# EAGLE design mightywatt (EAGLE 6.4)
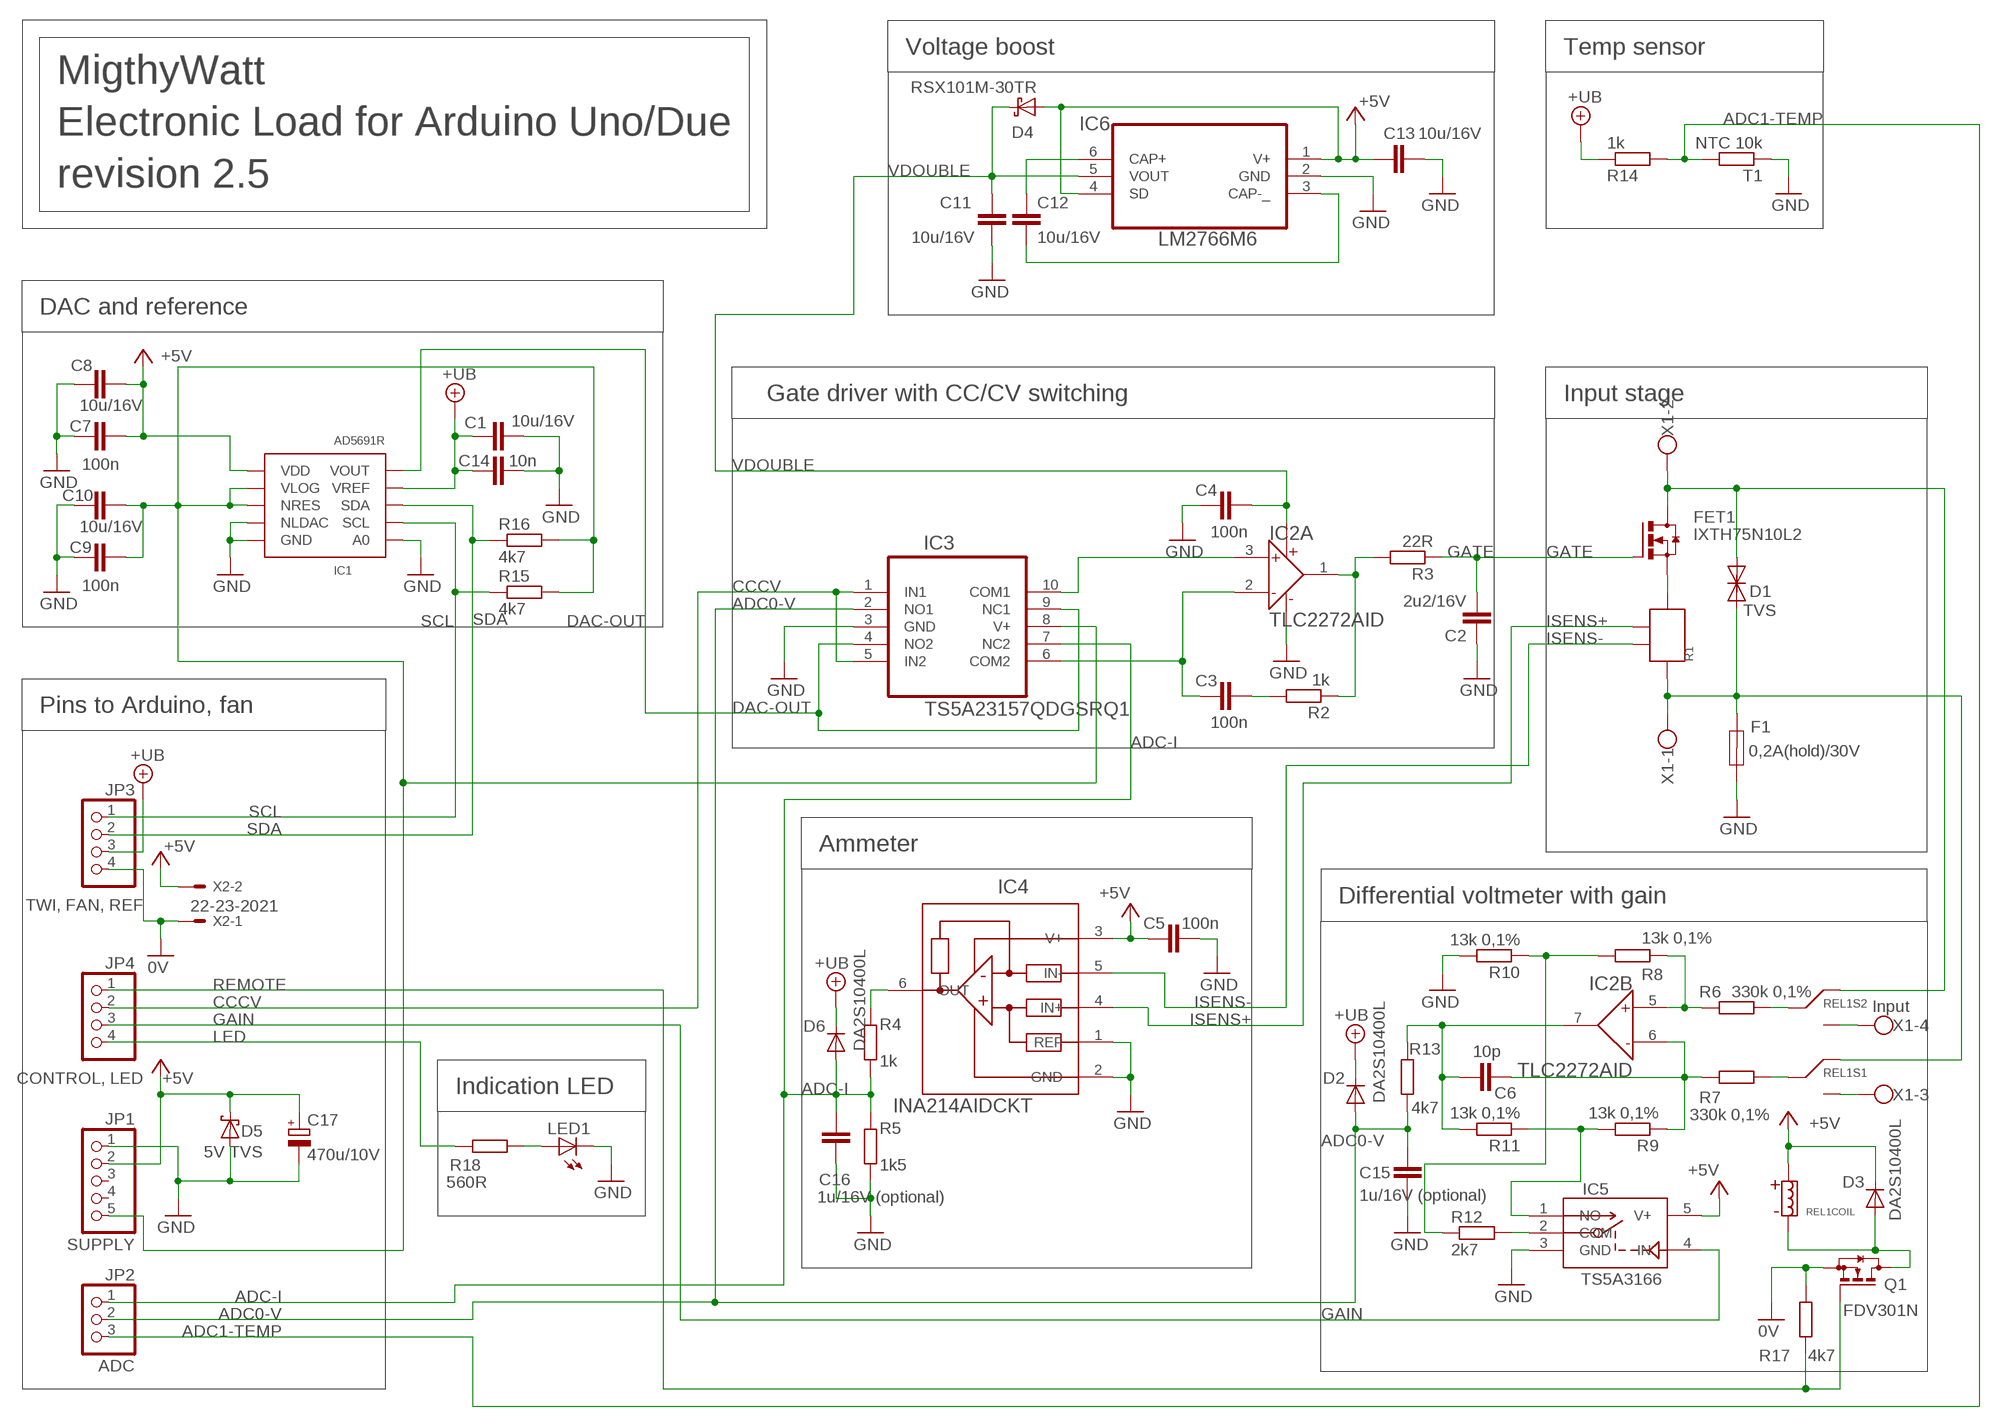
[diagram p0: schematic, sheet 1]

## Parts
C1  10u/16V  C-EUC1206  [C1206]
C2  2u2/16V  C-EUC1206  [C1206]
C3  100n  C-EUC0603  [C0603]
C4  100n  C-EUC0603  [C0603]
C5  100n  C-EUC0603  [C0603]
C6  10p  C-EUC0603  [C0603]
C7  100n  C-EUC0603  [C0603]
C8  10u/16V  C-EUC1206  [C1206]
C9  100n  C-EUC0603  [C0603]
C10  10u/16V  C-EUC1206  [C1206]
C11  10u/16V  C-EUC1206  [C1206]
C12  10u/16V  C-EUC1206  [C1206]
C13  10u/16V  C-EUC1206  [C1206]
C14  10n  C-EUC0805  [C0805]
C15  1u/16V (optional)  C-EUC0603  [C0603]
C16  1u/16V (optional)  C-EUC0603  [C0603]
C17  470u/10V  CPOL-EUSMCE  [SMC_E]
D1  TVS  DIODE-SMC  [SMC]
D2  DA2S10400L  DIODE-SOD523  [SOD523]
D3  DA2S10400L  DIODE-SOD523  [SOD523]
D4  RSX101M-30TR  DIODE-SOD123  [SOD123]
D5  5V TVS  SCHOTTKY-DIODESMD  [SMB]
D6  DA2S10400L  DIODE-SOD523  [SOD523]
F1  0,2A(hold)/30V  LITTELFUSE_1812_500MA  [R1812]
FET1  IXTH75N10L2  [TO-247AD-H]
IC1  AD5691RAD5691R  [SOP50P490X110-10N]
IC2  TLC2272AID  [SOIC127P600X175-8N]
IC3  TS5A23157QDGSRQ1  [SOP50P490X110-10N]
IC4  INA214AIDCKT  [SOT65P210X110-6N]
IC5  TS5A3166  [SC70-5]
IC6  LM2766M6  [SOT95P285X122-6N]
JP1  SUPPLY  PINHD-1X5  [1X05]
JP2  ADC  PINHD-1X3  [1X03]
JP3  TWI, FAN, REF  PINHD-1X4  [1X04]
JP4  CONTROL, LED  PINHD-1X4  [1X04]
LED1  LEDCHIP-LED0805  [CHIP-LED0805]
Q1  BSS123  [SOT23]
R1  WSL3637  [POWER-R-4TERM]
R2  1k  R-EU_R0603  [R0603]
R3  22R  R-EU_R0603  [R0603]
R4  1k  R-EU_R0603  [R0603]
R5  1k5  R-EU_R0603  [R0603]
R6  330k 0,1%  R-EU_R0603  [R0603]
R7  330k 0,1%  R-EU_R0603  [R0603]
R8  13k 0,1%  R-EU_R0603  [R0603]
R9  13k 0,1%  R-EU_R0603  [R0603]
R10  13k 0,1%  R-EU_R0603  [R0603]
R11  13k 0,1%  R-EU_R0603  [R0603]
R12  2k7  R-EU_R0603  [R0603]
R13  4k7  R-EU_R0603  [R0603]
R14  1k  R-EU_R0603  [R0603]
R15  4k7  R-EU_R0603  [R0603]
R16  4k7  R-EU_R0603  [R0603]
R17  4k7  R-EU_R0603  [R0603]
R18  560R  R-EU_R0603  [R0603]
REL1  IM03NS  [IM03NS-NARROW-RELAY]
T1  NTC 10k  R-EU_R0402  [R0402]
X1  Input  W237-4  [W237-4]
X2  22-23-2021  [22-23-2021]

## Nets
0V: JP3.4 Q1.2(S) R17.1 X2.1
+5V: C5.1 C7.2 C8.2 C13.1 C17.+ D3.C D4.A D5.C IC1.1(VDD) IC4.3(V+) IC5.5(V+) IC6.1(V+) IC6.4(SD) JP1.2 REL1.P$1(COIL:C+) X2.2
+UB: C1.1 C14.1 D2.C D6.C IC1.9(VREF) JP3.3 R14.1
ADC0-V: C15.2 D2.A IC3.2(NO1) JP2.2 R13.1
ADC1-TEMP: JP2.3 R14.2 T1.2
ADC-I: C16.2 D6.A IC3.7(NC2) JP2.1 R4.2 R5.1
CCCV: IC3.1(IN1) IC3.5(IN2) JP4.2
DAC-OUT: IC1.10(VOUT) IC3.4(NO2) IC3.9(NC1)
GAIN: IC5.4(IN) JP4.3
GATE: C2.2 FET1.G R3.1
GND: C1.2 C2.1 C4.1 C5.2 C7.1 C8.1 C9.1 C10.1 C11.2 C13.2 C14.2 C15.1 C16.1 C17.- D5.A F1.2 IC1.4(NLDAC) IC1.5(GND) IC1.6(A0) IC2.4(C:V-/GND) IC3.3(GND) IC4.1(REF) IC4.2(GND) IC5.3(GND) IC6.2(GND) JP1.1 LED1.C R5.2 R10.2 T1.1
IOREF: C9.2 C10.2 IC1.2(VLOG) IC1.3(NRES) IC3.8(V+) JP1.5 R15.2 R16.2
ISENS+: IC4.4(IN+) R1.SENSE2
ISENS-: IC4.5(IN-) R1.SENSE1
LED: JP4.4 R18.1
N$1: IC2.5(B:IN+) R6.2 R8.1
N$2: D1.A F1.1 R1.POWER1 REL1.P$2(S1:NC) X1.1
N$3: C6.1 IC2.6(B:IN-) R7.2 R9.1
N$4: D1.C FET1.D REL1.P$7(S2:NC) X1.2
N$5: C12.1 IC6.6(CAP+)
N$6: C12.2 IC6.3(CAP-_)
N$8: R8.2 R10.1 R12.1
N$9: REL1.P$4(S1:NO) X1.3
N$10: REL1.P$5(S2:NO) X1.4
N$11: FET1.S R1.POWER2
N$12: IC2.1(A:OUT) R2.1 R3.2
N$13: R6.1 REL1.P$6(S2:COM)
N$14: IC5.2(COM) R12.2
N$15: IC5.1(NO) R9.2 R11.1
N$16: LED1.A R18.2
N$17: R7.1 REL1.P$3(S1:COM)
N$18: C3.2 R2.2
N$19: C3.1 IC2.2(A:IN-) IC3.6(COM2)
N$20: C6.2 IC2.7(B:OUT) R11.2 R13.2
N$23: IC2.3(A:IN+) IC3.10(COM1)
N$24: D3.A Q1.3(D) REL1.P$8(COIL:C-)
R3: IC4.6(OUT) R4.1
REMOTE: JP4.1 Q1.1(G) R17.2
SCL: IC1.7(SCL) JP3.1 R15.1
SDA: IC1.8(SDA) JP3.2 R16.1
VDOUBLE: C4.2 C11.1 D4.C IC2.8(C:V+) IC6.5(VOUT)
Unconnected: JP1.3 JP1.4

## Notes on the sheet
- MigthyWatt
  Electronic Load for Arduino Uno/Due
  revision 2.5
- Voltage boost | Temp sensor
- DAC and reference
- Gate driver with CC/CV switching | Input stage
- Pins to Arduino, fan
- Ammeter
- Differential voltmeter with gain
- Indication LED

## Library data of the parts
C1-C16 = rcl:C-EU: CAPACITOR, European symbol
C17 = rcl:CPOL-EU: POLARIZED CAPACITOR, European symbol
D1 = diode-tvs:DIODE-: DIODE
D2 D3 D6 = diode:DIODE-: DIODE
D4 = diode-schottky:DIODE-: DIODE
D5 = diode:SCHOTTKY-DIODE: Schottky Diode
F1 = fuses_polyswitch:LITTELFUSE_1812; MPN: 1812L050PR; OC_FARNELL: 1597001; PACKAGE: 1812; SUPPLIER: LITTELFUSE
FET1 = fet:IXTH75N10L2: IXYS L2 POWER MOSFET
IC1 = load:AD5691R: Analog Devices AD5691R 12-bit DAC I2C, REF out; MODEL: AD5691R
IC2 = load:TLC2272AID: OPERATIONAL AMPLIFIERS; MPN: TLC2272AID; OC_FARNELL: 1470357; OC_NEWARK: 08F9015; PACKAGE: SOIC-8; SUPPLIER: Texas Instruments
IC3 = load:TS5A23157QDGSRQ1: 5-V/3.3-V 2-CHANNEL 2:1 MULTIPLEXER/DEMULTIPLEXER; MPN: TS5A23157QDGSRQ1; OC_FARNELL: 2322041; PACKAGE: MSOP-10; SUPPLIER: Texas Instruments
IC4 = load:INA214AIDCKT: CURRENT SHUNT MONITOR; MPN: INA214BIDCKT; OC_FARNELL: 1754262; OC_NEWARK: 05N1041; PACKAGE: SC-70-6; SUPPLIER: Texas Instruments
IC5 = load:TS5A3166: 0.9-Ohm SPST analog switch
IC6 = texas:LM2766M6: IC SW CAP/DBLR ADJ 20MA; MPN: LM2766M6; OC_FARNELL: 1685633; OC_NEWARK: 41K4345; PACKAGE: SOT-23-6; SUPPLIER: National Semiconductor
JP1 = pinhead (actionpin-3,4,5,6):PINHD-1X5: PIN HEADER
JP2 = pinhead (actionpin-3,4,5,6):PINHD-1X3: PIN HEADER
JP3 JP4 = pinhead (actionpin-3,4,5,6):PINHD-1X4: PIN HEADER
LED1 = led:LED: LED OSRAM: - CHIPLED LG R971, LG N971, LY N971, LG Q971, LY Q971, LO R971, LY R971 LH N974, LH R974 LS Q976, LO Q976, LY Q976 LO Q996 - Hyper CHIPLED LW Q18S LB Q993, LB Q99A, LB R99A - SideLED LS A670, LO A670, LY A670, LG A670, LP A670 LB A673, LV A673, LT A673, LW A673 LH A674 LY A675 LS A676, LA A676, LO A676, LY A676, LW A676 LS A679, LY A679, LG A679 - Hyper Micro SIDELED® LS Y876, LA Y876, LO Y876, LY Y876 LT Y87S - SmartLED LW L88C, LW L88S LB L89C, LB L89S, LG L890 LS L89K, LO L89K, LY L89K LS L896, LA L896, LO L896, LY L896 - TOPLED LS T670, LO T670, LY T670, LG T670, LP T670 LSG T670, LSP T670, LSY T670, LOP T670, LYG T670 LG T671, LOG T671, LSG T671 LB T673, LV T673, LT T673, LW T673 LH T674 LS T676, LA T676, LO T676, LY T676, LB T676, LH T676, LSB T676, LW T676 LB T67C, LV T67C, LT T67C, LS T67K, LO T67K, LY T67K, LW E67C LS E67B, LA E67B, LO E67B, LY E67B, LB E67C, LV E67C, LT E67C LW T67C LS T679, LY T679, LG T679 LS T770, LO T770, LY T770, LG T770, LP T770 LB T773, LV T773, LT T773, LW T773 LH T774 LS E675, LA E675, LY E675, LS T675 LS T776, LA T776, LO T776, LY T776, LB T776 LHGB T686 LT T68C, LB T68C - Hyper Mini TOPLED® LB M676 - Mini TOPLED Santana® LG M470 LS M47K, LO M47K, LY M47K Source: http://www.osram.convergy.de LUXEON: - LUMILED® LXK2-PW12-R00, LXK2-PW12-S00, LXK2-PW14-U00, LXK2-PW14-V00 LXK2-PM12-R00, LXK2-PM12-S00, LXK2-PM14-U00 LXK2-PE12-Q00, LXK2-PE12-R00, LXK2-PE12-S00, LXK2-PE14-T00, LXK2-PE14-U00 LXK2-PB12-K00, LXK2-PB12-L00, LXK2-PB12-M00, LXK2-PB14-N00, LXK2-PB14-P00, LXK2-PB14-Q00 LXK2-PR12-L00, LXK2-PR12-M00, LXK2-PR14-Q00, LXK2-PR14-R00 LXK2-PD12-Q00, LXK2-PD12-R00, LXK2-PD12-S00 LXK2-PH12-R00, LXK2-PH12-S00 LXK2-PL12-P00, LXK2-PL12-Q00, LXK2-PL12-R00 Source: www.luxeon.com KINGBRIGHT: KA-3528ASYC Source: www.kingbright.com
Q1 = transistor-small-signal:BSS123: N-CHANNEL MOS FET; PARTNAME: FDV301N
R1 = moje:WSL3637
R2-R18 T1 = rcl:R-EU_: RESISTOR, European symbol
REL1 = relays:IM03NS: Relay DPDT THT narrow 5V: IM03NS, UA2-5NU
X1 = con-wago-500-modified:W237-4: WAGO SCREW CLAMP; OC_FARNELL: unknown; OC_NEWARK: unknown
X2 = con-molex:22-23-2021: .100" (2.54mm) Center Header - 2 Pin; MF: MOLEX; MPN: 22-23-2021; OC_FARNELL: 1462926; OC_NEWARK: 25C3832

## Board
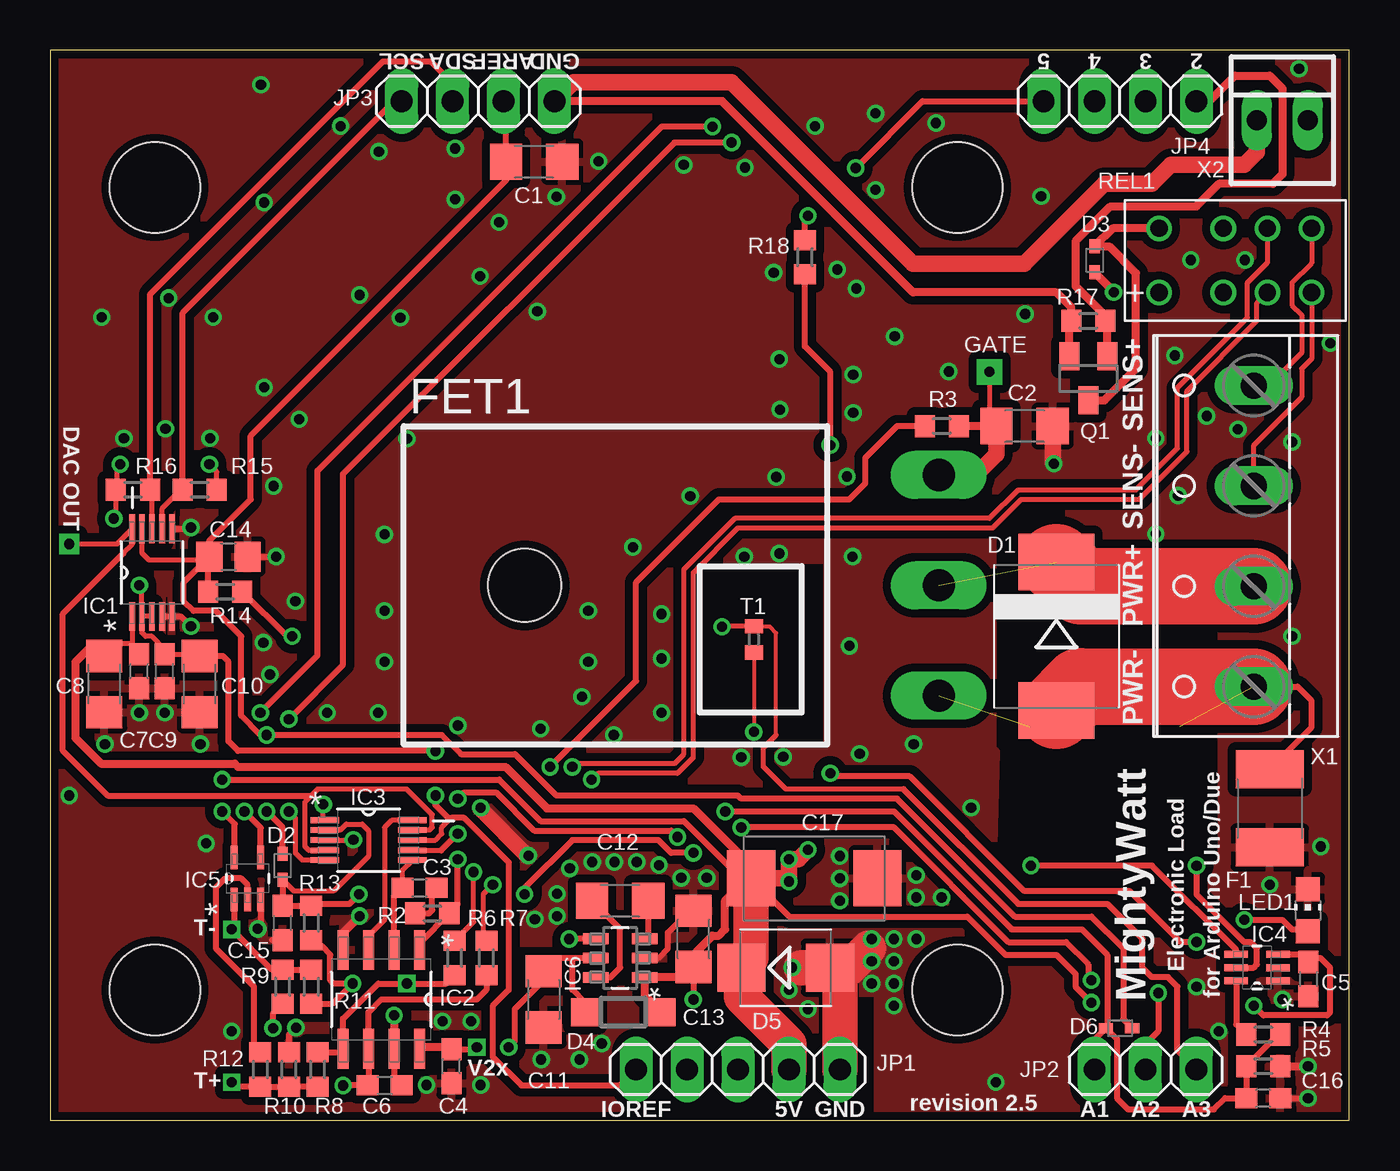
[diagram p1: board, top side]
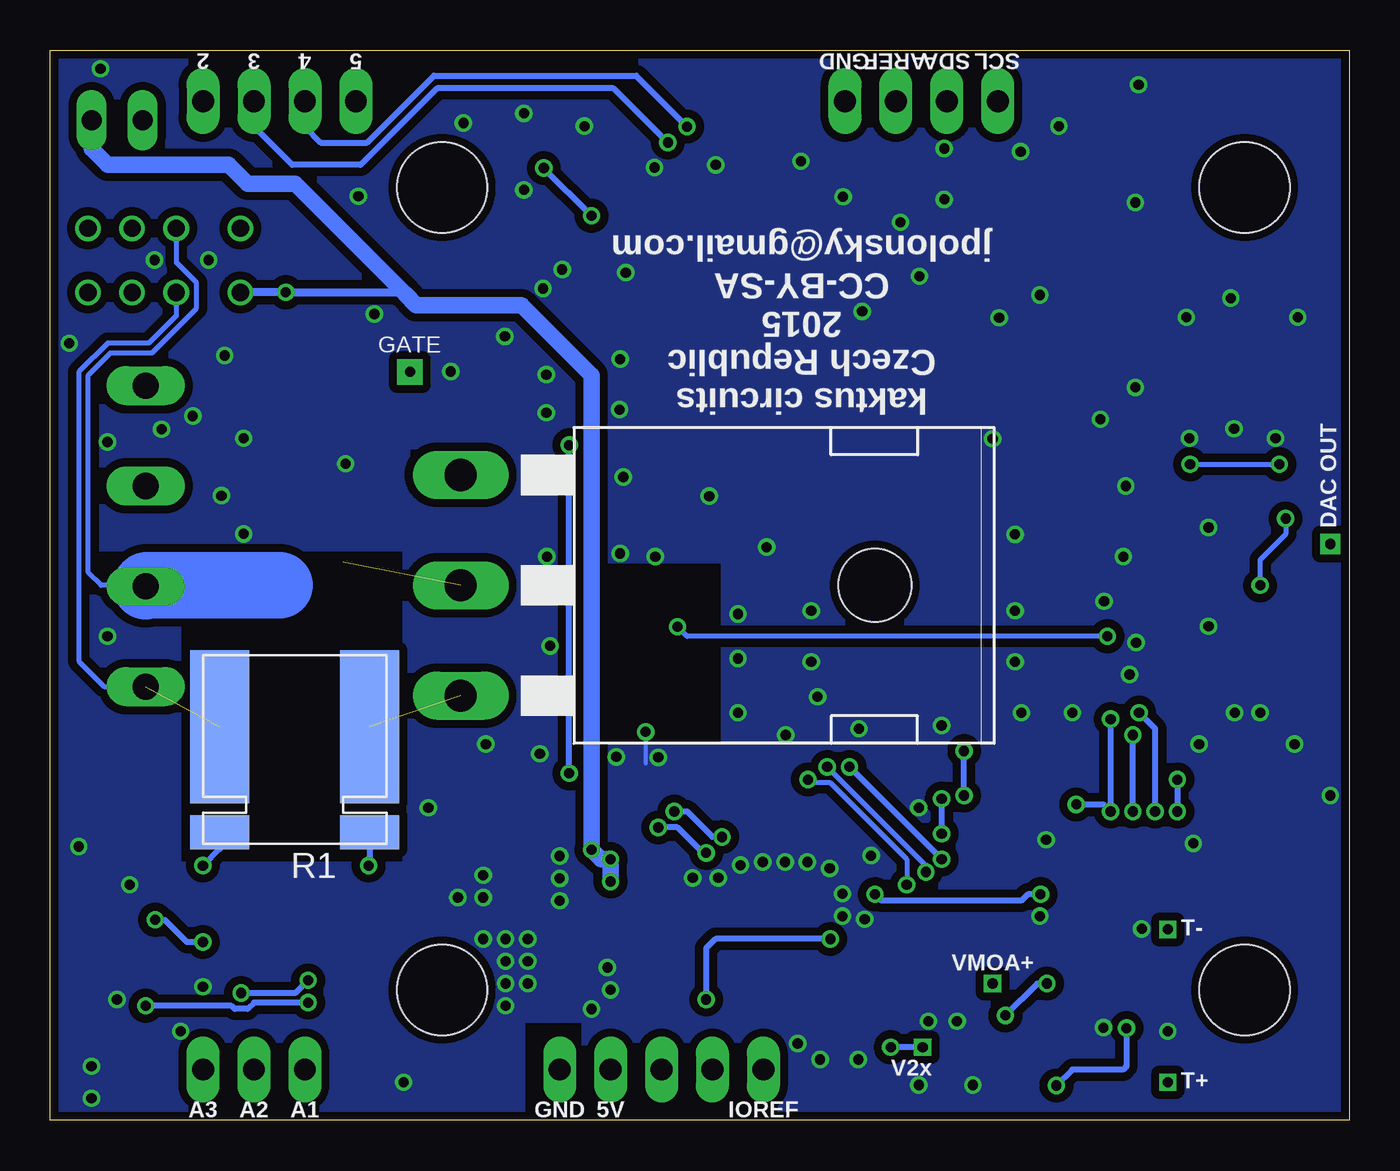
[diagram p2: board, bottom side, seen from below]

Size 64.77 x 53.34 mm. Coordinates in mm from the lower left corner, seen from the top.
Outline: 0,0 64.77,0 64.77,53.34 0,53.34 0,0
Copper layers (1*16): Top 0.0356mm / dielectric 1.5011mm / Bottom 0.0356mm
Design rules "OSHPark - LaenPCBOrder *": minimum track width 6mil, minimum drill 13mil, track to track 6mil, track to pad 6mil, pad to pad 6mil, via to via 6mil, smd to smd 6mil, copper to edge 15mil, drill to drill 6mil, minimum pad ring 7mil, minimum via ring 7mil, stop-mask expansion 3mil, vias tented up to drill 0mil, thermal gap 10mil
Holes 4.5 mm at 5.23,6.5 5.23,46.5 45.23,46.5 45.23,6.5

### Footprints (pad centres in the part's own frame; a part is rotated, then mirrored left to right if it is on the bottom)
C1206 = smd 1.6 x 1.8: 1 -1.4,0; 2 1.4,0
C0603 = smd 1.1 x 1: 1 -0.85,0; 2 0.85,0
C0805 = smd 1.3 x 1.5: 1 -0.95,0; 2 0.95,0
SMC_E = smd 2.4 x 2.8: + -3.15,0; - 3.15,0
SMC = smd 2.8 x 3.8: A 3.7,0; C -3.7,0
SOD523 = smd 0.7 x 0.5: A 0.7,0; C -0.6,0
SOD123 = smd 1.4 x 1.4: A 1.9,0; C -1.9,0
SMB = smd 2.4 x 2.4: A 2.2,0; C -2.2,0
R1812 = smd 1.9 x 3.4: 1 -1.95,0; 2 1.95,0
TO-247AD-H = drill 1.6 long: D 0,-20.65; G -5.5,-20.65; S 5.5,-20.65 | hole 3.65: 0,0
SOP50P490X110-10N = smd 1.422 x 0.279: 1 -2.184,0.991; 2 -2.184,0.508; 3 -2.184,0; 4 -2.184,-0.508; 5 -2.184,-0.991; 6 2.184,-0.991; 7 2.184,-0.508; 8 2.184,0; 9 2.184,0.508; 10 2.184,0.991
SOIC127P600X175-8N = smd 1.981 x 0.559: 1 -2.464,1.905; 2 -2.464,0.635; 3 -2.464,-0.635; 4 -2.464,-1.905; 5 2.464,-1.905; 6 2.464,-0.635; 7 2.464,0.635; 8 2.464,1.905
SOT65P210X110-6N = smd 1.168 x 0.356: 1 -1.041,0.66; 2 -1.041,0; 3 -1.041,-0.66; 4 1.041,-0.66; 5 1.041,0; 6 1.041,0.66
SC70-5 = smd 1.168 x 0.356: 1 -1.041,0.66; 2 -1.041,0; 3 -1.041,-0.66; 4 1.041,-0.66; 5 1.041,0.66
SOT95P285X122-6N = smd 1.27 x 0.533: 1 -1.219,0.965; 2 -1.219,0; 3 -1.219,-0.965; 4 1.219,-0.965; 5 1.219,0; 6 1.219,0.965
1X05 = drill 1.092 long: 1 -5.08,0; 2 -2.54,0; 3 0,0; 4 2.54,0; 5 5.08,0
1X03 = drill 1.092 long: 1 -2.54,0; 2 0,0; 3 2.54,0
1X04 = drill 1.092 long: 1 -3.81,0; 2 -1.27,0; 3 1.27,0; 4 3.81,0
CHIP-LED0805 = smd 1.2 x 1.2: A 0,-1.05; C 0,1.05
SOT23 = smd 1 x 1.4: 1 -0.95,-1.1; 2 0.95,-1.1; 3 0,1.1
POWER-R-4TERM = smd 7.62 x 2.946: POWER1 1.016,-2.972; POWER2 1.016,4.496 | smd 1.676 x 2.946: SENSE1 6.274,-2.972; SENSE2 6.274,4.496
R0603 = smd 1 x 1.1: 1 -0.85,0; 2 0.85,0
IM03NS-NARROW-RELAY = drill 0.85: P$1 -2.5,-1.6; P$2 0.7,-1.6; P$3 2.9,-1.6; P$4 5.1,-1.6; P$5 5.1,1.6; P$6 2.9,1.6; P$7 0.7,1.6; P$8 -2.5,1.6
R0402 = smd 0.7 x 0.9: 1 -0.65,0; 2 0.65,0
W237-4 = drill 1.3 long: 1 -7.5,-1.27; 2 -2.5,-1.27; 3 2.5,-1.27; 4 7.5,-1.27
22-23-2021 = drill 1 long: 1 -1.27,0; 2 1.27,0

### Placement (x,y rotation side)
C1  24.13,47.78 0 top
C2  48.58,34.61 180 top
C3  18.41,11.59 0 top
C4  20,2.7 90 top
C5  62.72,7.05 270 top
C6  16.67,1.75 0 top
C7  4.45,22.38 90 top
C8  2.7,21.75 90 top
C9  5.71,22.38 90 top
C10  7.46,21.75 90 top
C11  24.61,6.03 270 top
C12  28.42,10.95 0 top
C13  32.07,9.05 90 top
C14  8.89,28.1 0 top
C15  11.59,9.84 90 top
C16  60.48,1.11 180 top
C17  38.1,12.06 0 top
D1  50.16,24.13 270 top
D2  11.59,12.7 270 top
D3  52.07,42.86 90 top
D4  28.57,5.4 0 top
D5  36.67,7.62 0 top
D6  53.34,4.6 180 top
F1  60.8,15.56 270 top
FET1  23.65,26.67 270 bottom
IC1  5.08,27.3 90 top
IC2  16.51,6.03 270 top
IC3  15.88,13.97 0 top
IC4  60.17,7.62 180 top
IC5  9.84,12.06 90 top
IC6  28.42,8.1 180 top
JP1  34.29,2.54 180 top
JP2  54.61,2.54 0 top
JP3  21.34,50.8 0 top
JP4  53.34,50.8 180 top
LED1  62.71,10.48 0 top
Q1  51.75,36.99 180 top
R1  53.34,20.64 270 bottom
R2  19.05,10.32 180 top
R3  44.45,34.61 180 top
R4  60.48,4.29 0 top
R5  60.48,2.7 0 top
R6  20.16,8.1 270 top
R7  21.75,8.1 270 top
R8  13.34,2.54 270 top
R9  11.59,6.67 90 top
R10  11.91,2.54 90 top
R11  13.02,6.67 270 top
R12  10.48,2.54 90 top
R13  13.02,9.84 270 top
R14  8.73,26.35 0 top
R15  7.46,31.43 0 top
R16  4.13,31.43 180 top
R17  51.75,39.85 0 top
R18  37.62,43.02 270 top
REL1  57.78,42.86 0 top
T1  35.08,23.97 90 top
X1  58.74,29.12 90 top
X2  61.44,49.85 0 top

### Tracks (layer width: path | path; a pad name or v marks a point on that pad's centre or on a via)
0V
  Top 0.406: JP3.4 33.5,50.8 43.02,41.27 50.16,41.27 50.9,40.54 R17.1 50.8,39.75 Q1.2
  Top 0.813: JP3.4 26.1,51.75 33.97,51.75 43.02,42.7 48.58,42.7 52.55,46.67 54.93,46.67 55.88,47.62 59.53,47.62 60.17,48.26 X2.1
+5V  (via drill 0.51)
  Top 0.254: IC1.1 4.09,23.75 | 4.09,23.75 3.3,23.75 C8.2 | C7.2 4.45,23.39 4.09,23.75
  Top 0.305: 31.55,7.13 C13.1 | IC6.4 v25.89,9.06 v25.88,9.05 | C13.1 32.07,7.94 | C13.1 v32.07,6.03 | v8.57,16.99 22.38,16.99 24.45,14.92 31.59,14.92 34.45,12.06 | IC4.3 62.34,8.28 C5.1 62.92,8.1 63.34,8.1 63.82,7.62 63.82,5.4 63.66,5.24 60.48,5.24 v60.01,5.71 | 34.45,12.06 C17.+ 36.85,10.16 45.72,10.16 47.62,8.26 50.16,8.26 51.12,7.3 51.12,6.67 v51.91,5.87 | 34.45,12.06 34.45,12.57 34.29,12.72 | IC5.5 9.21,13.13 9.21,14.76 v8.57,15.4
  Top 0.406: C8.2 2.35,23.5 1.91,23.5 1.27,22.86 1.27,19.05 2.54,17.78 9.21,17.78 9.37,17.62 22.7,17.62 24.77,15.56 32.07,15.56 34.29,13.34 34.29,12.72 | C13.1 32.22,7.8 32.22,8.41 33.02,9.21 33.34,9.21 33.66,9.53 33.66,10.95 34.29,11.59 34.47,11.59 C17.+ 34.92,12.09 34.9,12.09 | 31.55,7.13 IC6.1 29.64,6.24 D4.A | 34.45,7.64 D5.C | v53.02,41.27 53.02,41.31 D3.C
  Top 0.813: C17.+ 36.67,12.06 v36.83,11.91 v36.83,13.02 37.31,13.02 v37.78,13.49
  Top 1.778: JP1.2 36.83,3.81 34.47,6.17 D5.C 34.95,8.1 C17.+
  Bottom 0.305: v25.88,9.05 31.59,9.05 32.07,8.57 v32.07,6.03 | v8.57,16.99 v8.57,15.4 | v51.91,5.87 54.61,5.87 54.93,5.56 55.56,5.56 55.72,5.71 v60.01,5.71
  Bottom 0.406: REL1.P$1 55.27,41.27 v53.02,41.27 47.15,41.27 47.07,41.2
  Bottom 0.813: X2.2 62.71,48.42 61.91,47.62 55.88,47.62 54.93,46.67 52.55,46.67 47.07,41.2 46.51,40.64 41.27,40.64 37.78,37.15 v37.78,13.49 37.31,13.02 v36.83,13.02 v36.83,11.91
+UB  (via drill 0.51)
  Top 0.254: IC1.9 4.57,28.29 4.92,27.94 7.78,27.94 C14.1
  Top 0.305: JP3.3 22.73,50.68 C1.1 22.73,46.86 10,34.13 10,30.96 7.94,28.89 C14.1 | C14.1 6.67,26.83 6.67,25.88 7.14,25.4 8.26,25.4 9.53,24.13 9.53,20.16 10.48,19.21 v10.79,19.21 19.53,19.21 20.48,18.26 23.18,18.26 25.24,16.19 34.29,16.19 34.45,16.03 42.23,16.03 48.1,10.16 51.91,10.16 53.5,8.57 53.5,5.04 D6.C | R14.1 7.88,28.04 C14.1 | D2.C 11.59,14.61 v10.79,15.4
  Bottom 0.305: v10.79,15.4 v10.79,19.21
ADC0-V  (via drill 0.51)
  Top 0.254: 11.84,11.75 D2.A 12.16,11.43 14.13,11.43 15.88,13.18 15.88,14.45 15.56,14.76 14.76,14.76 14.48,14.48 IC3.2
  Top 0.305: v51.91,6.99 51.75,7.14 51.75,7.78 50.64,8.89 47.78,8.89 42.07,14.61 v34.45,14.61 | v32.07,13.34 30.96,13.34 30.32,13.97 26.04,13.97 23.65,11.59 v23.65,11.27 | D2.A C15.2 R13.1 13.12,10.79 14.92,10.79 v15.4,11.27 | v55.24,6.35 55.24,4.45 54.61,3.81 JP2.2
  Bottom 0.305: v23.65,11.27 23.34,10.95 16.35,10.95 16.03,11.27 v15.4,11.27 | v51.91,6.99 52.55,6.35 v55.24,6.35 | v32.07,13.34 32.23,13.34 33.5,14.61 v34.45,14.61
ADC1-TEMP  (via drill 0.51)
  Top 0.203: T1.2 35.86,24.62 36.2,24.29 36.2,19.21
  Top 0.254: 42.55,16.51 36.67,16.51 35.56,17.62 35.56,18.57 36.2,19.21 | T1.2 33.51,24.62 v33.5,24.61
  Top 0.305: JP2.3 56.2,3.49 56.2,6.67 55.72,7.14 54.93,7.14 54.45,7.62 54.45,9.05 52.7,10.79 48.26,10.79 42.55,16.51 | v12.06,24.13 11.8,24.13 R14.2
  Bottom 0.254: v12.06,24.13 33.02,24.13 v33.5,24.61
ADC-I  (via drill 0.51)
  Top 0.254: IC3.7 19.49,13.46
  Top 0.305: 19.49,13.46 v20.32,14.29 | v20.32,16.03 20.64,16.35 22.23,16.35 24.13,14.45 30.96,14.45 v31.27,14.13 | v33.66,15.4 42.07,15.4 47.94,9.53 51.44,9.53 52.7,8.26 52.7,4.67 D6.A | R4.2 61.33,4.4 R5.1 C16.2 58.58,1.11 58.02,0.56 53.74,0.56 53.18,1.11 53.18,4.06 D6.A | JP2.1 52.07,4.03 D6.A
  Bottom 0.305: v20.32,14.29 v20.32,16.03 | v33.66,15.4 33.02,15.4 31.75,14.13 v31.27,14.13
CCCV  (via drill 0.51)
  Top 0.254: IC3.1 13.61,15.04 v13.61,15.75 | IC3.5 12.58,12.98 12.22,13.34 12.22,15.08 v11.91,15.4
  Top 0.305: v33.97,48.74 31.11,48.74 14.61,32.23 14.61,22.7 v11.91,20
  Bottom 0.305: v33.97,48.74 36.67,51.44 45.48,51.44 49.29,47.62 52.7,47.62 54.61,49.53 JP4.2 | v13.61,15.75 12.26,15.75 v11.91,15.4 v11.91,20
DAC-OUT  (via drill 0.51 pad 1.02)
  Top 0.254: v0.95,28.73 3.33,28.73 IC1.10 4.09,28.7 3.65,28.26 | IC3.9 18.92,14.48 19.05,14.61 19.05,15.24 17.78,16.51 13.34,16.51 13.02,16.19 12.7,15.88 12.7,13.65 12.89,13.46 IC3.4
  Top 0.305: 3.65,28.26 0.64,25.24 0.64,18.41 2.86,16.19 13.02,16.19
GAIN  (via drill 0.51)
  Top 0.305: v33.02,49.53 30.48,49.53 13.34,32.38 13.34,23.18 v10.48,20.32 | IC5.4 10.5,14.58 v9.68,15.4
  Bottom 0.305: v33.02,49.53 35.56,52.07 45.64,52.07 48.97,48.74 51.28,48.74 52.07,49.53 JP4.3 | v9.68,15.4 9.68,19.53 v10.48,20.32
GATE  (via drill 0.51 pad 1.27)
  Top 0.254: v46.83,37.31 46.83,34.95 C2.2
  Top 0.406: C2.2 R3.1
  Top 0.813: FET1.G 46.14,32.17 47.18,33.21 C2.2
GND  (via drill 0.51)
  Top 0.203: T1.1 v35.08,19.37
  Top 0.254: IC3.3 15.09,13.97 v15.11,13.99
  Top 0.305: R10.2 11.91,4.28 v12.26,4.63 | IC1.6 6.96,29.49 v7.02,29.55 | IC1.4 IC1.5 6.53,25.12 v7.02,24.63 | IC6.2 30.32,8.1 30.8,8.57 30.8,9.37 31.59,10.16 31.78,10.16 C13.2 | C14.2 v11.27,28.1 | C16.1 v62.71,1.11 | IC5.3 10.5,9.86 | C15.1 11.07,8.99
  Top 0.406: R5.2 v62.71,2.7 | IC2.4 14.61,9.36 v15.43,10.18
  Top 0.813: C2.1 49.98,32.79 v50.04,32.73 | 21.43,15.56 23.81,13.18
  Top 1.778: 39.37,7.12 D5.A | 37.47,7.62 39.37,7.62 | 39.37,7.62 39.85,7.62 40.8,8.57 | JP1.1 39.37,7.62
  Bottom 0.203: v35.08,19.37 35.08,17.78
  other vias: 60.8,11.75 0.95,16.19 2.57,40.03 27.34,47.81 63.34,13.65 61.44,6.03 4.45,20.32 5.71,20.32 2.73,18.76 7.49,18.76 47.15,1.91 16.38,48.28 20.19,48.44 10.51,51.62 7.97,34 39.72,32.09 40.2,41.46 43.05,18.76 25.24,46.04 19.56,4.95 40.01,28.1 39.85,23.65 24.45,19.53 8.13,40.03 29.05,28.57 30.48,25.24 30.48,20.32 30.48,23.02 28.1,19.21 34.45,18.1 10.35,9.55 18.77,1.77 40.04,37.17 42.1,39.08 48.61,40.19 55.12,34 56.07,38.12 56.87,42.89 59.56,42.89 57.66,35.11 56.23,31.14 55.12,29.23 38.13,49.55 41.15,46.38 34.64,47.49 36.07,42.25 61.91,24.13 61.91,33.81 59.21,34.45 63.82,38.73 36.99,7.62 40.96,6.83 40.96,7.94 40.96,9.05 42.07,9.05 42.07,7.94 36.83,6.51 62.26,52.41 42.07,6.83 43.18,9.05 42.07,5.71 37.78,5.56 44.8,37.33 7.78,13.81 3.68,34 20.19,45.9 15.43,41.14 10.67,36.54 12.42,34.95 11.15,31.62 22.38,44.77 17.46,40.01 31.59,47.62 21.43,42.07 24.29,40.32 17.78,33.97 16.67,29.21 31.91,31.11 20.32,19.68 26.51,21.11 36.2,32.07 36.35,37.94 34.61,28.1 45.91,15.58 16.35,20.32 13.81,20.32 10.95,22.23 12.22,25.88 40.36,18.28 36.55,18.12 21.46,15.58 16.67,25.4 16.67,22.86 26.83,25.4 26.83,22.86 25.27,11.3 24.48,3.04 32.74,12.09 23.85,13.2 10.64,23.81 5.91,40.98 10.67,45.74 14.48,49.55 5.75,34.47 39.24,42.41 36.39,35.43 49.4,46.06 44.17,49.71 41.15,50.19 9.05,4.45 39.37,13.18 39.37,10.95 39.37,12.06 43.18,12.22 43.18,11.11 44.45,11.11 25.91,12.57 27.02,12.88 28.13,12.88 29.24,12.88 30.35,12.72 31.47,12.09 25.27,10.18 24.16,10.03 27.5,3.83 26.39,3.04 21.46,1.77 20.99,4.95 40.04,35.27 36.35,28.26 57.15,6.67 58.26,4.45
  pour Bottom (isolate 0.406): 0,19.05 47.62,18.41 46.99,12.7 58.42,12.7 58.42,33.66 64.77,33.66 64.77,0 41.27,0 41.27,5.08 38.1,5.08 38.1,0 0,0
  pour Bottom (isolate 0.406): 46.99,33.66 0,33.66 0,53.34 64.77,53.34 64.77,28.57 46.99,28.57
  pour Top (isolate 0.406): 46.99,33.66 24.61,33.66 24.61,53.34 64.77,53.34 64.77,33.66 58.42,33.66 58.42,24.77 46.99,24.77
  pour Top (isolate 0.406): 37.94,44.45 37.47,44.45 37.47,53.34 0,53.34 0,32.86 37.94,32.86
  pour Bottom (isolate 0.406): 31.11,18.73 31.11,27.94 38.73,27.94 38.73,18.41 46.99,18.41 46.99,33.66 0,33.66 0,19.05
  pour Top (isolate 0.406): 31.11,18.73 31.11,27.94 38.73,27.94 38.73,18.41 46.99,18.41 46.99,34.29 0,34.29 0,19.05
  pour Top (isolate 0.406): 0,19.05 47.15,18.41 46.99,12.7 58.42,12.7 58.42,47.62 64.77,47.62 64.77,0 41.27,0 41.27,6.35 38.1,6.35 38.1,0 0,0
IOREF  (via drill 0.51)
  Top 0.254: IC1.3 IC1.2 | IC1.2 4.57,24.32 4.76,24.13 5.08,24.13 5.71,23.5 C9.2 7.38,23.23 C10.2 | IC3.8 19.21,13.97 19.53,14.29 19.53,14.61 19.92,15 | R15.2 8.31,32.33 v7.94,32.7 | IC1.2 4.57,26.54 v4.45,26.67 | v3.17,30 3.28,30.11 R16.2 3.33,31.49 3.33,32.54 v3.49,32.7
  Top 0.305: JP1.5 28.42,1.75 23.5,1.75 22.07,3.17 22.07,5.71 22.86,6.51 22.86,12.86 20.64,15.08 20,15.08 19.92,15 19.21,15.72 v19.21,16.19 | C10.2 8.6,23.15 8.89,22.86 8.89,18.89 9.37,18.41 v19.21,18.41
  Bottom 0.254: v7.94,32.7 v3.49,32.7 | v4.45,26.67 4.45,27.94 3.17,29.21 v3.17,30
  Bottom 0.305: v19.21,16.19 v19.21,18.41
ISENS+  (via drill 0.51)
  Top 0.305: v48.9,12.7 54.93,12.7 59.12,8.5 IC4.4
  Bottom 0.305: R1.SENSE2 48.84,12.75 v48.9,12.7
ISENS-  (via drill 0.51)
  Top 0.305: v57.15,12.7 57.15,11.27 59.53,8.89 59.85,8.89 60.17,8.57 60.17,7.78 60.01,7.62 IC4.5
  Bottom 0.305: v57.15,12.7 56.31,13.54 R1.SENSE1
LED  (via drill 0.51)
  Top 0.305: R18.1 37.62,44.93 v37.78,45.09 | v40.16,47.47 43.5,50.8 JP4.4
  Bottom 0.305: v37.78,45.09 v40.16,47.47
N$1  (via drill 0.51)
  Top 0.305: R8.1 14.43,3.39 IC2.5 14.61,5.08 16.35,6.83 v17.78,6.83 19.74,6.83 R6.2
N$2  (1 unrouted)
  Top 0.305: X1.1 62.2,21.62 62.87,20.95 62.87,19.57 F1.1
  Top 3.81: X1.1 51.37,21.62 51.37,21.63 D1.A
  Bottom 0.254: X1.1 62.07,21.62 63.34,22.89 63.34,37.31 61.91,38.73 59.85,38.73 58.48,40.1 REL1.P$2
N$3  (via drill 0.51)
  Top 0.305: R7.2 21.75,6.51 21.27,6.03 16.51,6.03 15.88,5.4 IC2.6 15.88,1.8 C6.1 v14.61,1.75 | v11.11,4.6 11.11,5.34 R9.1
  Bottom 0.305: v11.11,4.6 11.11,2.7 11.27,2.54 13.81,2.54 v14.61,1.75
N$4  (1 unrouted)
  Top 3.302: 51.37,26.63 51.06,26.93
  Top 3.81: X1.2 51.37,26.62 51.06,26.93 D1.C
  Bottom 0.254: 59.96,26.67 62.23,26.67 62.87,27.3 62.87,37.15 61.75,38.26 59.69,38.26 57.47,40.48 57.47,41.75 58.48,42.77 REL1.P$7
  Bottom 3.302: X1.2 59.96,26.67 53.34,26.67
N$5
  Top 0.305: IC6.6 27.93,7.13 28.42,7.62 28.42,9.55 C12.1
N$6
  Top 0.305: C12.2 29.82,9.24 IC6.3
N$8  (via drill 0.51)
  Top 0.305: R8.2 R10.1 R12.1 9.26,1.69 v9.05,1.91
N$9
  Top 0.254: X1.3 60.01,33.66 62.39,36.04 62.39,37.47 62.88,37.96 REL1.P$4
N$10
  Top 0.254: REL1.P$5 62.88,42.72 61.91,41.75 61.91,40.64 62.39,40.16 62.39,38.26 60.75,36.62 X1.4
N$11  (1 unrouted)
N$12  (via drill 0.51)
  Top 0.305: R3.2 42.23,34.61 40.64,33.02 40.64,31.75 39.85,30.96 33.34,30.96 29.21,26.83 29.21,21.91 v24.92,17.62 | 18.41,8.89 18.47,8.89 | 18.47,8.89 R2.1 19.9,10.38 20.32,10.79 v20.32,13.02 | IC2.1 18.41,8.83 18.47,8.89
  Bottom 0.305: v24.92,17.62 v20.32,13.02
N$13  (via drill 0.51)
  Top 0.254: v21.11,12.38 21.11,9.9 R6.1 | REL1.P$6 60.69,42.75 59.69,41.75 59.69,40.01 56.2,36.51 56.2,33.5 54.13,31.43 48.26,31.43 46.83,30 34.13,30 31.59,27.46 31.59,18.26 31.11,17.78 26.19,17.78 v26.04,17.62
  Bottom 0.254: v21.11,12.38 21.11,12.7 v26.04,17.62
N$14
  Top 0.305: IC5.2 9.84,11.75 9.53,12.06 8.73,12.06 8.26,11.59 8.26,8.57 10.16,6.67 10.16,3.81 10.48,3.49 R12.2
N$15  (via drill 0.51)
  Top 0.305: R11.1 R9.2 11.05,7.52 v9.05,9.53 9.18,9.66 IC5.1
N$16  (via drill 0.51)
  Top 0.305: v57.15,8.89 56.36,8.89 53.82,11.43 48.58,11.43 42.86,17.14 39.05,17.14 v38.89,17.3 | v59.53,10 61.44,10 61.91,9.53 62.61,9.53 LED1.A | v38.89,33.66 38.89,37.31 37.62,38.58 R18.2
  Bottom 0.305: v59.53,10 59.05,10 57.94,8.89 v57.15,8.89 | v38.89,17.3 v38.89,33.66
N$17  (via drill 0.51)
  Top 0.254: v22.07,11.75 21.59,11.27 21.59,9.11 R7.1 | REL1.P$3 60.17,40.74 60.17,39.85 56.67,36.35 56.67,33.34 54.29,30.96 48.42,30.96 46.99,29.53 34.29,29.53 32.07,27.3 32.07,18.1 31.27,17.3 27.3,17.3 v26.99,16.99
  Bottom 0.254: v22.07,11.75 22.07,13.02 25.88,16.83 26.83,16.83 v26.99,16.99
N$18
  Top 0.305: R2.2 18.89,10.32 19.05,10.48 19.05,11.37 C3.2
N$19
  Top 0.254: C3.1 17.57,12.48 IC3.6
  Top 0.305: IC2.2 17.14,11.17 C3.1
N$20  (via drill 0.51)
  Top 0.305: R11.2 14.07,5.82 v15.08,6.83 14.13,6.83 13.97,6.99 13.97,8.26 13.57,8.65 13.49,8.73 13.23,8.99 R13.2 | IC2.7 17.14,2.12 C6.2
  Top 0.406: v17.14,5.24 IC2.7
  Bottom 0.305: v15.08,6.83 15.56,6.83 v17.14,5.24
N$23
  Top 0.254: IC2.3 15.88,9.21 16.67,10 16.67,14.61 17.02,14.96 IC3.10
N$24
  Top 0.406: REL1.P$8 52.97,44.46 D3.A 52.8,43.56 54.13,42.23 54.13,37.47 52.56,35.89 Q1.3
R3
  Top 0.305: IC4.6 59.12,4.79 R4.1
REMOTE
  Top 0.406: JP4.1 57.78,50.8 59.05,52.07 60.8,52.07 61.44,51.44 61.44,47.15 60.96,46.67 58.26,46.67 57.15,45.56 52.86,45.56 51.12,43.81 51.12,41.59 52.6,40.11 R17.2 52.7,39.75 Q1.1
SCL
  Top 0.254: IC1.7 5.59,30.51 6.51,31.43 R15.1
  Top 0.305: R15.1 6.61,40.27 17.14,50.8 JP3.1
SDA
  Top 0.254: IC1.8 5.08,31.11 | 5.08,31.11 5.08,31.17 | R16.1 4.98,31.22 5.08,31.11
  Top 0.305: R16.1 4.98,41.17 16.59,52.78 18.97,52.78 20.07,51.69 JP3.2
VDOUBLE  (via drill 0.51)
  Top 0.254: 18.52,3.68 18.41,3.68 IC2.8
  Top 0.305: D4.C 26.68,5.87 26.04,6.51 26.04,8.1 | IC6.5 26.04,8.1 | 26.04,8.1 25.27,8.1 C11.1 24.61,6.99 23.18,5.56 23.18,3.97 v22.86,3.65 | C4.2 21.17,3.55 v21.27,3.65
  Top 0.406: 18.52,3.68 19.87,3.68 C4.2
  Bottom 0.305: v21.27,3.65 v22.86,3.65

### Text on the board
tPlace: SCL | SDA | AREF | GND | 5 | 4 | 3 | 2 | GATE | SENS+ | DAC OUT | SENS- | PWR+ | PWR- | MightyWatt | Electronic Load / for Arduino Uno/Due | T- | T+ | V2x | IOREF | 5V | GND | revision 2.5 | A1 | A2 | A3
bPlace: SCL | SDA | AREF | GND | 5 | 4 | 3 | 2 | GATE | kaktus circuits / Czech Republic / 2015 / CC-BY-SA / jpolonsky@gmail.com | DAC OUT | T- | VMOA+ | T+ | V2x | IOREF | 5V | GND | A1 | A2 | A3